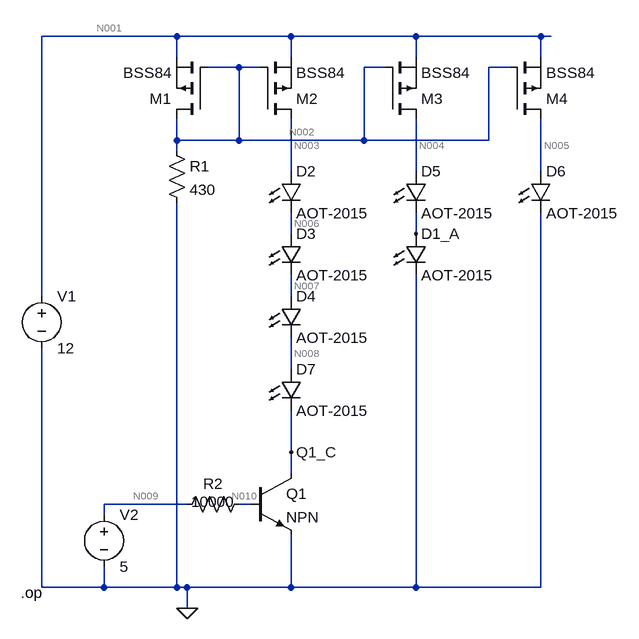
[diagram p0: schematic current_mirror_pmos.asc]
current_mirror_pmos.asc, the LTspice schematic file:
Version 4
SHEET 1 880 884
WIRE -144 -144 -352 -144
WIRE 32 -144 -144 -144
WIRE 224 -144 32 -144
WIRE 416 -144 224 -144
WIRE 432 -144 416 -144
WIRE -144 -112 -144 -144
WIRE 32 -112 32 -144
WIRE 224 -112 224 -144
WIRE 416 -112 416 -144
WIRE -48 -96 -96 -96
WIRE -16 -96 -48 -96
WIRE 176 -96 144 -96
WIRE 368 -96 336 -96
WIRE -144 16 -144 -16
WIRE -48 16 -48 -96
WIRE -48 16 -144 16
WIRE 144 16 144 -96
WIRE 144 16 -48 16
WIRE 336 16 336 -96
WIRE 336 16 144 16
WIRE -144 32 -144 16
WIRE 32 64 32 -16
WIRE 224 64 224 -16
WIRE 416 64 416 -16
WIRE 32 160 32 128
WIRE 224 160 224 128
WIRE -352 256 -352 -144
WIRE 32 256 32 224
WIRE 32 368 32 320
WIRE 32 496 32 432
WIRE 32 528 32 496
WIRE -128 576 -256 576
WIRE -32 576 -48 576
WIRE -256 592 -256 576
WIRE -352 704 -352 336
WIRE -256 704 -256 672
WIRE -256 704 -352 704
WIRE -144 704 -144 112
WIRE -144 704 -256 704
WIRE -128 704 -144 704
WIRE 32 704 32 624
WIRE 32 704 -128 704
WIRE 224 704 224 224
WIRE 224 704 32 704
WIRE 416 704 416 128
WIRE 416 704 224 704
WIRE -128 736 -128 704
FLAG -128 736 0
FLAG 224 160 D1_A
FLAG 32 496 Q1_C
SYMBOL pmos -96 -16 R180
SYMATTR InstName M1
SYMATTR Value BSS84
SYMBOL pmos -16 -16 M180
SYMATTR InstName M2
SYMATTR Value BSS84
SYMBOL res -160 16 R0
SYMATTR InstName R1
SYMATTR Value 430
SYMBOL voltage -352 240 R0
WINDOW 123 0 0 Left 2
WINDOW 39 0 0 Left 2
SYMATTR InstName V1
SYMATTR Value 12
SYMBOL pmos 176 -16 M180
SYMATTR InstName M3
SYMATTR Value BSS84
SYMBOL LED 208 160 R0
SYMATTR InstName D1
SYMATTR Value AOT-2015
SYMATTR Description Diode
SYMATTR Type diode
SYMBOL pmos 368 -16 M180
SYMATTR InstName M4
SYMATTR Value BSS84
SYMBOL LED 16 64 R0
SYMATTR InstName D2
SYMATTR Value AOT-2015
SYMBOL LED 16 160 R0
SYMATTR InstName D3
SYMATTR Value AOT-2015
SYMBOL LED 16 256 R0
SYMATTR InstName D4
SYMATTR Value AOT-2015
SYMBOL LED 208 64 R0
SYMATTR InstName D5
SYMATTR Value AOT-2015
SYMBOL LED 400 64 R0
SYMATTR InstName D6
SYMATTR Value AOT-2015
SYMBOL npn -32 528 R0
SYMATTR InstName Q1
SYMBOL voltage -256 576 R0
WINDOW 123 0 0 Left 2
WINDOW 39 0 0 Left 2
SYMATTR InstName V2
SYMATTR Value 5
SYMBOL res -32 560 R90
WINDOW 0 0 56 VBottom 2
WINDOW 3 28 56 VBottom 2
SYMATTR InstName R2
SYMATTR Value 10000
SYMBOL LED 16 368 R0
SYMATTR InstName D7
SYMATTR Value AOT-2015
TEXT -384 712 Left 2 !.op

The netlist it stands for:
* current_mirror_pmos.asc
M1 N002 N002 N001 N001 BSS84
M2 N003 N002 N001 N001 BSS84
R1 N002 0 430
V1 N001 0 12
M3 N004 N002 N001 N001 BSS84
D1 D1_A 0 AOT-2015
M4 N005 N002 N001 N001 BSS84
D2 N003 N006 AOT-2015
D3 N006 N007 AOT-2015
D4 N007 N008 AOT-2015
D5 N004 D1_A AOT-2015
D6 N005 0 AOT-2015
Q1 Q1_C N010 0 0 NPN
V2 N009 0 5
R2 N010 N009 10000
D7 N008 Q1_C AOT-2015
.model D D
.lib standard.dio
.model NPN NPN
.model PNP PNP
.lib standard.bjt
.model NMOS NMOS
.model PMOS PMOS
.lib standard.mos
.op
.backanno
.end

* Results of the author's LTspice run, read from the files saved beside the schematic
* Operating Point:
*   V(n002) = 9.393 V
*   V(n001) = 12 V
*   V(n003) = 11.43 V
*   V(n004) = 5.653 V
*   V(d1_a) = 2.826 V
*   V(n005) = 2.826 V
*   V(n006) = 8.602 V
*   V(n007) = 5.775 V
*   V(n008) = 2.949 V
*   V(q1_c) = 122.9 mV
*   V(n010) = 854.4 mV
*   V(n009) = 5 V
*   Ic(Q1) = 21.84 mA
*   Ib(Q1) = 414.6 µA
*   Ie(Q1) = -22.26 mA
*   Id(M4) = -21.84 mA
*   Ig(M4) = -3.311 pA
*   Is(M4) = 21.84 mA
*   Id(M3) = -21.84 mA
*   Ig(M3) = -5.017 pA
*   Is(M3) = 21.84 mA
*   Id(M2) = -21.84 mA
*   Ig(M2) = -39.54 pA
*   Is(M2) = 21.84 mA
*   Id(M1) = -21.84 mA
*   Ig(M1) = -25.62 pA
*   Is(M1) = 21.84 mA
*   I(D7) = 21.84 mA
*   I(D6) = 21.84 mA
*   I(D5) = 21.84 mA
*   I(D4) = 21.84 mA
*   I(D3) = 21.84 mA
*   I(D2) = 21.84 mA
*   I(D1) = 21.84 mA
*   I(R2) = -414.6 µA
*   I(R1) = 21.84 mA
*   I(V2) = -414.6 µA
*   I(V1) = -87.38 mA
* From the log:
*   Semiconductor Device Operating Points:
*                           --- Diodes ---
*   Name:      d7          d6          d5          d4          d3
*   Model:  aot-2015    aot-2015    aot-2015    aot-2015    aot-2015
*   Id:      2.18e-02    2.18e-02    2.18e-02    2.18e-02    2.18e-02
*   Vd:      2.83e+00    2.83e+00    2.83e+00    2.83e+00    2.83e+00
*   Req:     7.37e+00    7.37e+00    7.37e+00    7.37e+00    7.37e+00
*   CAP:     2.34e-09    2.34e-09    2.34e-09    2.34e-09    2.34e-09
*   Name:      d2          d1
*   Model:  aot-2015    aot-2015
*   Id:      2.18e-02    2.18e-02
*   Vd:      2.83e+00    2.83e+00
*   Req:     7.37e+00    7.37e+00
*   CAP:     2.34e-09    2.34e-09
*                           --- Bipolar Transistors ---
*   Name:       q1
*   Model:      npn
*   Ib:       4.15e-04
*   Ic:       2.18e-02
*   Vbe:      8.54e-01
*   Vbc:      7.32e-01
*   Vce:      1.23e-01
*   BetaDC:   5.27e+01
*   Gm:       8.52e-01
*   Rpi:      1.16e+02
*   Rx:       0.00e+00
*   Ro:       1.35e+02
*   Cbe:      0.00e+00
*   Cbc:      0.00e+00
*   Cjs:      0.00e+00
*   BetaAC:   9.91e+01
*   Cbx:      0.00e+00
*   Ft:       0.00e+00
*                           --- VDMOSFET Transistors ---
*   Name:          m4          m3          m2          m1
*   Model:        bss84       bss84       bss84       bss84
*   Id:         -2.18e-02   -2.18e-02   -2.18e-02   -2.18e-02
*   Vgs:        -2.61e+00   -2.61e+00   -2.61e+00   -2.61e+00
*   Vds:        -9.17e+00   -6.35e+00   -5.72e-01   -2.61e+00
*   Vth:        -2.10e+00   -2.10e+00   -2.10e+00   -2.10e+00
*   Gm:          9.35e-02    9.35e-02    9.35e-02    9.35e-02
*   Gds:         0.00e+00    0.00e+00    0.00e+00    0.00e+00
*   Cgs:         2.00e-11    2.00e-11    2.00e-11    2.00e-11
*   Cgd:         3.31e-12    5.02e-12    3.95e-11    2.56e-11
*   Cbody:       3.14e-12    3.69e-12    7.98e-12    5.27e-12